# Altium schematic sheet Sheet2.SchDoc
size A3; SheetNumber: 2; SheetTotal: 2
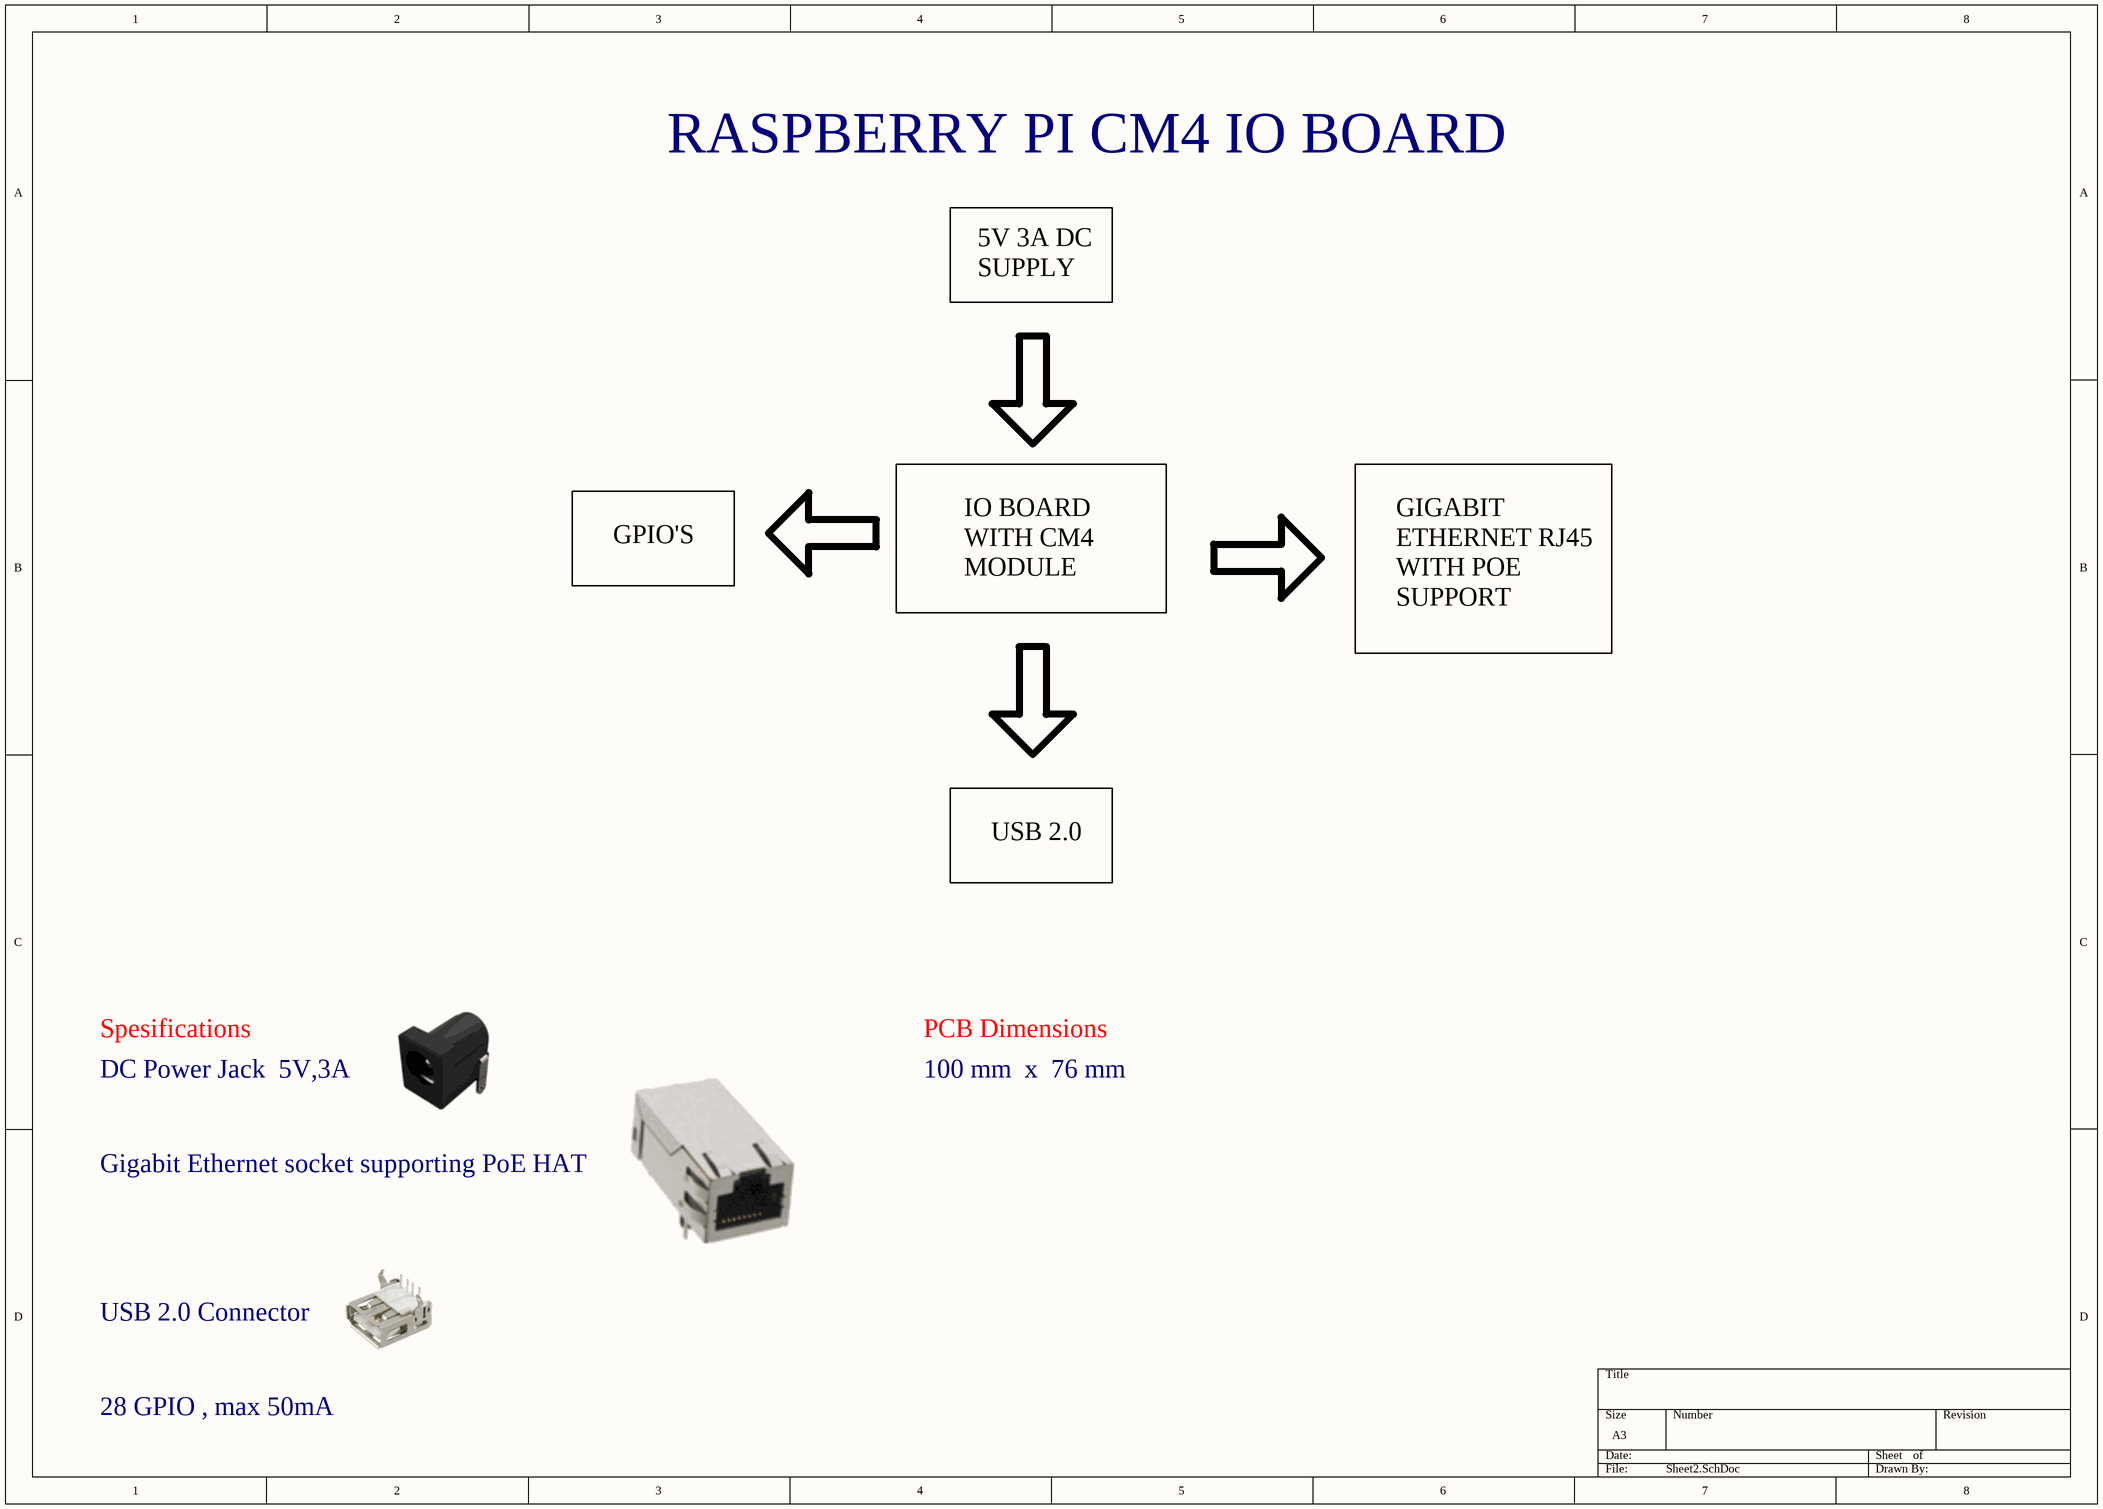
[diagram p0: Sheet2.SchDoc]

## Notes on the sheet
- RASPBERRY PI CM4 IO BOARD
- 5V 3A DC SUPPLY
- GPIO'S
- IO BOARD
  WITH CM4 MODULE
- GIGABIT ETHERNET RJ45 WITH POE SUPPORT
- USB 2.0
- Spesifications
- PCB Dimensions
- DC Power Jack  5V,3A
- 100 mm  x  76 mm
- Gigabit Ethernet socket supporting PoE HAT
- USB 2.0 Connector
- 28 GPIO , max 50mA